# Altium schematic sheet IO.SchDoc
size A4
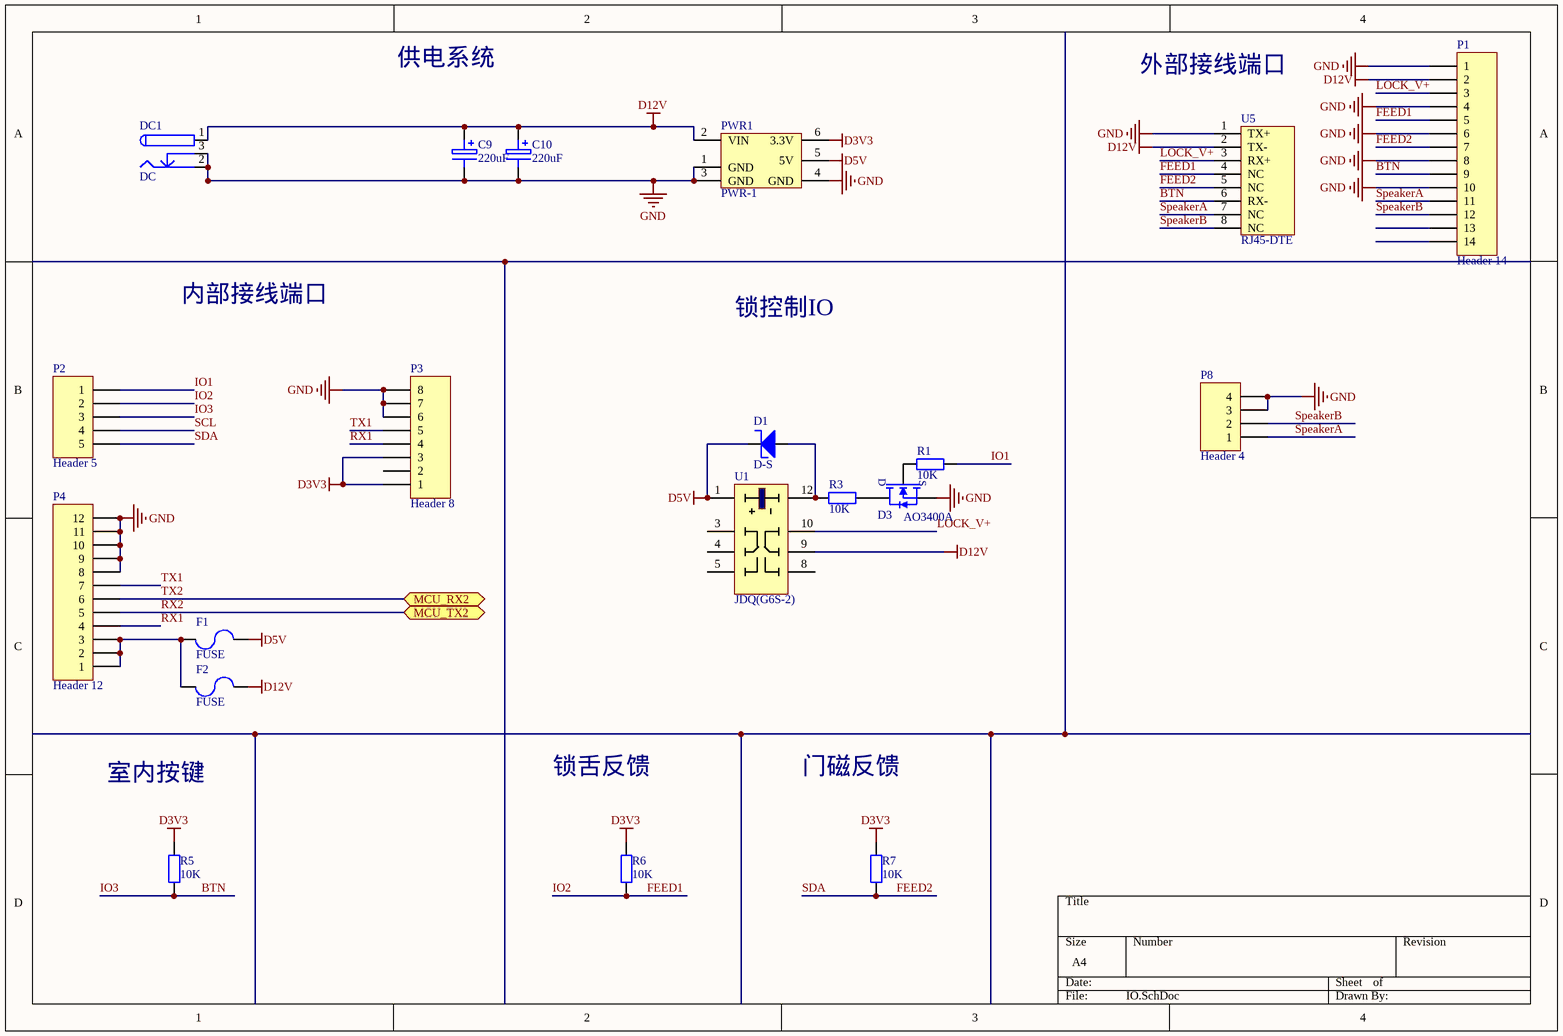
[diagram p0: IO.SchDoc]

## Parts
C9  220uF  [RB.2/.4]
C10  220uF  [RB.2/.4]
D1  D-S  [DO-214AC(SMA)]
D3  AO3400A  [SOT23A]
DC1  DC  [DC005]
F1  FUSE  [0805F]
F2  FUSE  [0805F]
P1  Header 14  [KF128-5.08-14]
P2  Header 5  [XH2.54-5]
P3  Header 8  [FPC/1.25T-6P]
P4  Header 12  [FFC/SM1.0-2H10]
P8  Header 4  [FPC/1.25T-2P]
PWR1  PWR-1  [PWR-1]
R1  10K  [0603R]
R3  10K  [0603R]
R5  10K  [0603R]
R6  10K  [0603R]
R7  10K  [0603R]
U1  JDQ(G6S-2)  [JDQ-G6S-2]
U5  RJ45-DTE  [RJ45]

## Ports
MCU_RX2 (bidir), MCU_TX2 (bidir)

## Nets
D3V3: P3.1 P3.3 PWR1.6(3.3V) R5.2 R6.2 R7.2
D5V: D1.K F1.1 PWR1.5(5V) U1.1
D12V: C9.1 C10.1 DC1.1 F2.1 P1.2 PWR1.2(VIN) U1.9 U5.2(TX-)
GND: C9.2 C10.2 D3.2(S) DC1.2 DC1.3 P1.1 P1.4 P1.6 P1.8 P1.10 P3.6 P3.7 P3.8 P4.8 P4.9 P4.10 P4.11 P4.12 P8.3 P8.4 PWR1.1(GND) PWR1.3(GND) PWR1.4(GND) U5.1(TX+)
BTN: P1.9 P2.3 R5.1 U5.6(RX-)  [also labelled IO3]
FEED1: P1.5 P2.2 R6.1 U5.4(NC)  [also labelled IO2]
FEED2: P1.7 P2.5 R7.1 U5.5(NC)  [also labelled SDA]
IO1: P2.1 R1.2
LOCK_V+: P1.3 U1.10 U5.3(RX+)
RX1: P3.4 P4.4
RX2: P4.5 ; port MCU_TX2
SCL: P2.4
SpeakerA: P1.11 P8.1 U5.7(NC)
SpeakerB: P1.12 P8.2 U5.8(NC)
TX1: P3.5 P4.7
TX2: P4.6 ; port MCU_RX2
NetD1_A: D1.A R3.1 U1.12
NetD3_1: D3.1(G) R1.1
NetD3_3: D3.3(D) R3.2
NetF1_2: F1.2 F2.2 P4.1 P4.2 P4.3

Not connected (* = marked no-connect by the designer): P1 13 14; P3 2; U1 3 4 5 8

## Notes on the sheet
- 供电系统
- 外部接线端口
- 内部接线端口
- 锁控制IO
- 室内按键
- 锁舌反馈
- 门磁反馈

## Library data of the parts
C9 C10 = CAP-E: 电解电容; 电压: 16V
D1 = D-S: 肖特基二极管
D3 = MOS-N: NMOS
DC1 = DC00X: 圆形电源接口
F1 F2 = FUSE: CR-1812-050A60V
P1 = Header 14: Header, 14-Pin; LatestRevisionDate: 17-Jul-2002; LatestRevisionNote: Re-released for DXP Platform.; Publisher: Altium Limited
P2 = Header 5: Header, 5-Pin; LatestRevisionDate: 17-Jul-2002; LatestRevisionNote: Re-released for DXP Platform.; Publisher: Altium Limited
P3 = Header 8: Header, 8-Pin; LatestRevisionDate: 17-Jul-2002; LatestRevisionNote: Re-released for DXP Platform.; Publisher: Altium Limited
P4 = Header 12: Header, 12-Pin; LatestRevisionDate: 17-Jul-2002; LatestRevisionNote: Re-released for DXP Platform.; Publisher: Altium Limited
P8 = Header 4: Header, 4-Pin; LatestRevisionDate: 17-Jul-2002; LatestRevisionNote: Re-released for DXP Platform.; Publisher: Altium Limited
R1 R3 R5-R7 = RES: 普通电阻
U1 = JDQ(G6S-2): 继电器（G6S-2 5VDC）